# EAGLE schematic XBee Teensy Test (EAGLE 7.6.0)
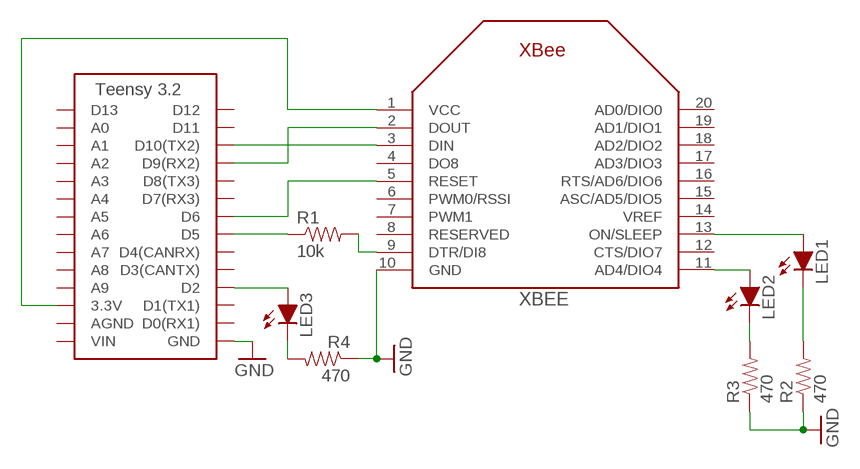
[diagram p0: schematic, sheet 1]

## Parts
LED1  LED-5MM  [LED-5MM]
LED2  LED-5MM  [LED-5MM]
LED3  LED-5MM  [LED-5MM]
R1  10k  RESISTOREZ  [AXIAL-0.3EZ]
R2  470  RESISTOREZ  [AXIAL-0.3EZ]
R3  470  RESISTOREZ  [AXIAL-0.3EZ]
R4  470  RESISTOREZ  [AXIAL-0.3EZ]
U$2  TEENSY_3.2_SIMPLE  [TEENSY_3.2_SIMPLE]
XBEE  XBEE  [XBEE]

## Nets
GND: R2.P$1 R3.P$1 R4.P$1 U$2.GND XBEE.10(GND)
N$1: R1.P$2 XBEE.9(DTR/DI8)
N$2: U$2.D9(RX2) XBEE.2(DOUT)
N$3: U$2.D10(TX2) XBEE.3(DIN)
N$4: U$2.D6 XBEE.5(RESET)
N$5: R1.P$1 U$2.D5
N$6: LED2.A XBEE.11(AD4/DIO4)
N$7: LED1.A XBEE.13(ON/SLEEP)
N$8: LED1.K(C) R2.P$2
N$9: LED2.K(C) R3.P$2
N$10: LED3.K(C) R4.P$2
N$11: LED3.A U$2.D2
VCC: U$2.3.3V XBEE.1(VCC)
Unconnected: U$2.A0 U$2.A1 U$2.A2 U$2.A3 U$2.A4 U$2.A5 U$2.A6 U$2.A7 U$2.A8 U$2.A9 U$2.AGND U$2.D0(RX1) U$2.D1(TX1) U$2.D3(CANTX) U$2.D4(CANRX) U$2.D7(RX3) U$2.D8(TX3) U$2.D11 U$2.D12 U$2.D13 U$2.VIN XBEE.4(DO8) XBEE.6(PWM0/RSSI) XBEE.7(PWM1) XBEE.8(RESERVED) XBEE.12(CTS/DIO7) XBEE.14(VREF) XBEE.15(ASC/AD5/DIO5) XBEE.16(RTS/AD6/DIO6) XBEE.17(AD3/DIO3) XBEE.18(AD2/DIO2) XBEE.19(AD1/DIO1) XBEE.20(AD0/DIO0)

## Library data of the parts
LED1-LED3 = HyTechDevices:LED: Light Emitting Diode (LED) Source: Dangerous Prototypes Eagle Library <https://github.com/DangerousPrototypes/Eagle_Part_Library>
R1-R4 = HyTechDevices:RESISTOR: Resistor Basic schematic elements and footprints for 0603, 1206, and PTH resistors.
U$2 = HyTechDevices:TEENSY_3.2_SIMPLE: Simple version of the Teensy 3.2 board that only uses the 2 main rows of pins, not the inner pins or the pins opposite the usb port.
XBEE = HyTechDevices:XBEE: Source: Adafruit <https://github.com/adafruit/Adafruit-Eagle-Library>